# EAGLE design pet_cpu816-v1.2b (EAGLE 4.15)
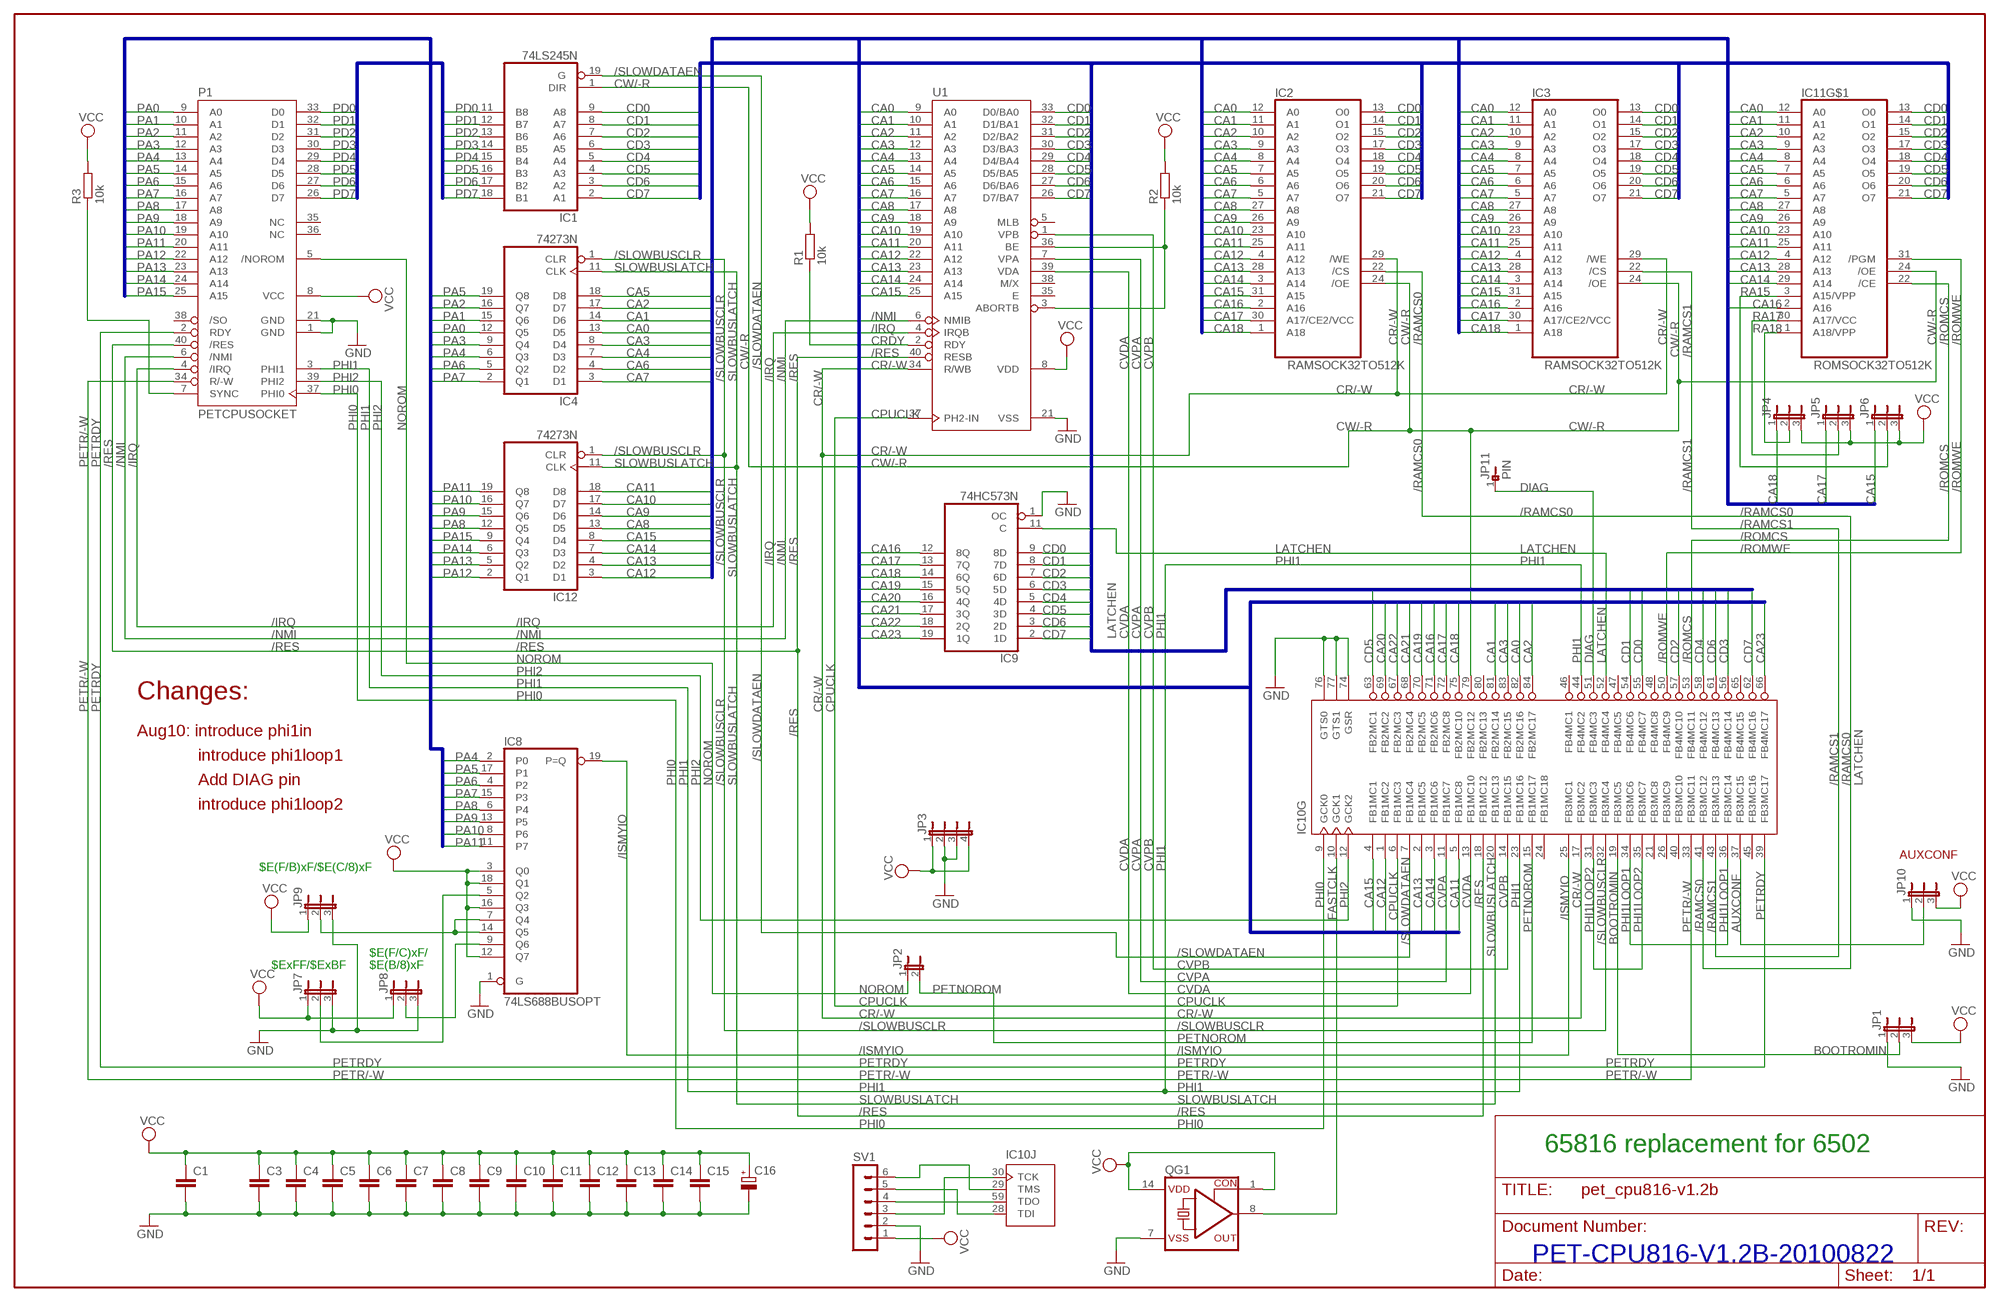
[diagram p0: schematic, sheet 1]

## Parts
C1  C-EU050-025X075  [C050-025X075]
C3  C-EU050-025X075  [C050-025X075]
C4  C-EU050-025X075  [C050-025X075]
C5  C-EU050-025X075  [C050-025X075]
C6  C-EU050-025X075  [C050-025X075]
C7  C-EU050-025X075  [C050-025X075]
C8  C-EU050-025X075  [C050-025X075]
C9  C-EU050-025X075  [C050-025X075]
C10  C-EU050-025X075  [C050-025X075]
C11  C-EU050-025X075  [C050-025X075]
C12  C-EU050-025X075  [C050-025X075]
C13  C-EU050-025X075  [C050-025X075]
C14  C-EU050-025X075  [C050-025X075]
C15  C-EU050-025X075  [C050-025X075]
C16  CPOL-EUE2.5-7  [E2,5-7]
IC1  74LS245N  [DIL20]
IC2  RAMSOCK32TO512K  [DIL32OPT28]
IC3  RAMSOCK32TO512K  [DIL32OPT28]
IC4  74273N  [DIL20]
IC8  74LS688BUSOPT  [DIL20]
IC9  74HC573N  [DIL20]
IC10  XC9572PC84  [PLCC-S84]
IC11  ROMSOCK32TO512K  [DIL32OPT28]
IC12  74273N  [DIL20]
JP1  JP2E  [JP2]
JP2  JP1E  [JP1]
JP3  JP4E  [JP4]
JP4  JP2E  [JP2]
JP5  JP2E  [JP2]
JP6  JP2E  [JP2]
JP7  JP2E  [JP2]
JP8  JP2E  [JP2]
JP9  JP2E  [JP2]
JP10  JP2E  [JP2]
JP11  PIN  [PIN]
P1  PETCPUSOCKET  [DIL40]
QG1  CRYSTAL_RES-SG51  [SG51]
R1  10k  R-EU_0204/7  [0204/7]
R2  10k  R-EU_0204/7  [0204/7]
R3  10k  R-EU_0204/7  [0204/7]
SV1  MA06-1  [MA06-1]
U1  W65C816SP  [DIP-40]

## Nets
/IRQ: P1.4(/IRQ) U1.4(IRQB)
/ISMYIO: IC8.19(P=Q) IC10.25(G:FB3MC1)
/NMI: P1.6(/NMI) U1.6(NMIB)
/RAMCS0: IC2.22(/CS) IC10.41(G:FB3MC12)
/RAMCS1: IC3.22(/CS) IC10.43(G:FB3MC13)
/RES: IC10.18(G:FB1MC12) P1.40(/RES) U1.40(RESB)
/ROMCS: IC10.53(G:FB4MC11) IC11.22(/CE)
/ROMWE: IC10.50(G:FB4MC9) IC11.31(/PGM)
/SLOWBUSCLR: IC4.1(CLR) IC10.32(G:FB3MC4) IC12.1(CLR)
/SLOWDATAEN: IC1.19(G) IC10.7(G:FB1MC4)
AUXCONF: IC10.37(G:FB3MC15) JP10.2
BOOTROMIN: IC10.19(G:FB3MC5) JP1.2
CA0: IC2.12(A0) IC3.12(A0) IC4.13(D5) IC10.82(G:FB2MC16) IC11.12(A0) U1.9(A0)
CA1: IC2.11(A1) IC3.11(A1) IC4.14(D6) IC10.81(G:FB2MC14) IC11.11(A1) U1.10(A1)
CA2: IC2.10(A2) IC3.10(A2) IC4.17(D7) IC10.84(G:FB2MC17) IC11.10(A2) U1.11(A2)
CA3: IC2.9(A3) IC3.9(A3) IC4.8(D4) IC10.83(G:FB2MC15) IC11.9(A3) U1.12(A3)
CA4: IC2.8(A4) IC3.8(A4) IC4.7(D3) IC11.8(A4) U1.13(A4)
CA5: IC2.7(A5) IC3.7(A5) IC4.18(D8) IC11.7(A5) U1.14(A5)
CA6: IC2.6(A6) IC3.6(A6) IC4.4(D2) IC11.6(A6) U1.15(A6)
CA7: IC2.5(A7) IC3.5(A7) IC4.3(D1) IC11.5(A7) U1.16(A7)
CA8: IC2.27(A8) IC3.27(A8) IC11.27(A8) IC12.13(D5) U1.17(A8)
CA9: IC2.26(A9) IC3.26(A9) IC11.26(A9) IC12.14(D6) U1.18(A9)
CA10: IC2.23(A10) IC3.23(A10) IC11.23(A10) IC12.17(D7) U1.19(A10)
CA11: IC2.25(A11) IC3.25(A11) IC10.5(G:FB1MC8) IC11.25(A11) IC12.18(D8) U1.20(A11)
CA12: IC2.4(A12) IC3.4(A12) IC10.1(G:FB1MC2) IC11.4(A12) IC12.3(D1) U1.22(A12)
CA13: IC2.28(A13) IC3.28(A13) IC10.2(G:FB1MC5) IC11.28(A13) IC12.4(D2) U1.23(A13)
CA14: IC2.3(A14) IC3.3(A14) IC10.3(G:FB1MC6) IC11.29(A14) IC12.7(D3) U1.24(A14)
CA15: IC2.31(A15) IC3.31(A15) IC10.4(G:FB1MC1) IC12.8(D4) JP6.1 U1.25(A15)
CA16: IC2.2(A16) IC3.2(A16) IC9.12(8Q) IC10.71(G:FB2MC6) IC11.2(A16)
CA17: IC2.30(A17/CE2/VCC) IC3.30(A17/CE2/VCC) IC9.13(7Q) IC10.72(G:FB2MC8) JP5.1
CA18: IC2.1(A18) IC3.1(A18) IC9.14(6Q) IC10.75(G:FB2MC10) JP4.1
CA19: IC9.15(5Q) IC10.70(G:FB2MC5)
CA20: IC9.16(4Q) IC10.69(G:FB2MC2)
CA21: IC9.17(3Q) IC10.68(G:FB2MC4)
CA22: IC9.18(2Q) IC10.67(G:FB2MC3)
CA23: IC9.19(1Q) IC10.66(G:FB4MC17)
CD0: IC1.9(A8) IC2.13(O0) IC3.13(O0) IC9.9(8D) IC10.55(G:FB4MC7) IC11.13(O0) U1.33(D0/BA0)
CD1: IC1.8(A7) IC2.14(O1) IC3.14(O1) IC9.8(7D) IC10.54(G:FB4MC6) IC11.14(O1) U1.32(D1/BA1)
CD2: IC1.7(A6) IC2.15(O2) IC3.15(O2) IC9.7(6D) IC10.57(G:FB4MC10) IC11.15(O2) U1.31(D2/BA2)
CD3: IC1.6(A5) IC2.17(O3) IC3.17(O3) IC9.6(5D) IC10.56(G:FB4MC14) IC11.17(O3) U1.30(D3/BA3)
CD4: IC1.5(A4) IC2.18(O4) IC3.18(O4) IC9.5(4D) IC10.58(G:FB4MC12) IC11.18(O4) U1.29(D4/BA4)
CD5: IC1.4(A3) IC2.19(O5) IC3.19(O5) IC9.4(3D) IC10.63(G:FB2MC1) IC11.19(O5) U1.28(D5/BA5)
CD6: IC1.3(A2) IC2.20(O6) IC3.20(O6) IC9.3(2D) IC10.61(G:FB4MC13) IC11.20(O6) U1.27(D6/BA6)
CD7: IC1.2(A1) IC2.21(O7) IC3.21(O7) IC9.2(1D) IC10.62(G:FB4MC16) IC11.21(O7) U1.26(D7/BA7)
CPUCLK: IC10.6(G:FB1MC3) U1.37(PH2-IN)
CR/-W: IC2.29(/WE) IC3.29(/WE) IC10.17(G:FB3MC2) U1.34(R/WB)
CRDY: R1.1 U1.2(RDY)
CVDA: IC10.13(G:FB1MC10) U1.39(VDA)
CVPA: IC10.11(G:FB1MC7) U1.7(VPA)
CVPB: IC10.14(G:FB1MC15) U1.1(VPB)
CW/-R: IC1.1(DIR) IC2.24(/OE) IC3.24(/OE) IC10.79(G:FB2MC12) IC11.24(/OE)
DIAG: IC10.51(G:FB4MC3) JP11.1
FASTCLK: IC10.10(G:GCK1) QG1.8(OUT)
GND: C1.2 C3.2 C4.2 C5.2 C6.2 C7.2 C8.2 C9.2 C10.2 C11.2 C12.2 C13.2 C14.2 C15.2 C16.- IC8.1(G) IC9.1(OC) IC10.74(G:GSR) IC10.76(G:GTS0) IC10.77(G:GTS1) JP1.1 JP3.2 JP3.3 JP7.3 JP8.3 JP9.3 JP10.1 P1.1(GND) P1.21(GND) QG1.7(VSS) SV1.2 U1.21(VSS)
LATCHEN: IC9.11(C) IC10.52(G:FB4MC4)
N$1: IC10.30(J:TCK) SV1.3
N$2: IC10.59(J:TDO) SV1.4
N$3: IC10.28(J:TDI) SV1.5
N$4: IC10.29(J:TMS) SV1.6
N$5: IC8.9(Q6) JP8.2
N$6: IC8.5(Q2) JP7.2
N$7: IC8.7(Q4) IC8.14(Q5) JP9.2
N$24: R2.1 U1.3(ABORTB) U1.36(BE)
NOROM: JP2.1 P1.5(/NOROM)
PA0: IC4.12(Q5) P1.9(A0)
PA1: IC4.15(Q6) P1.10(A1)
PA2: IC4.16(Q7) P1.11(A2)
PA3: IC4.9(Q4) P1.12(A3)
PA4: IC4.6(Q3) IC8.2(P0) P1.13(A4)
PA5: IC4.19(Q8) IC8.17(P1) P1.14(A5)
PA6: IC4.5(Q2) IC8.4(P2) P1.15(A6)
PA7: IC4.2(Q1) IC8.15(P3) P1.16(A7)
PA8: IC8.6(P4) IC12.12(Q5) P1.17(A8)
PA9: IC8.13(P5) IC12.15(Q6) P1.18(A9)
PA10: IC8.8(P6) IC12.16(Q7) P1.19(A10)
PA11: IC8.11(P7) IC12.19(Q8) P1.20(A11)
PA12: IC12.2(Q1) P1.22(A12)
PA13: IC12.5(Q2) P1.23(A13)
PA14: IC12.6(Q3) P1.24(A14)
PA15: IC12.9(Q4) P1.25(A15)
PD0: IC1.11(B8) P1.33(D0)
PD1: IC1.12(B7) P1.32(D1)
PD2: IC1.13(B6) P1.31(D2)
PD3: IC1.14(B5) P1.30(D3)
PD4: IC1.15(B4) P1.29(D4)
PD5: IC1.16(B3) P1.28(D5)
PD6: IC1.17(B2) P1.27(D6)
PD7: IC1.18(B1) P1.26(D7)
PETNOROM: IC10.15(G:FB1MC17) JP2.2
PETR/-W: IC10.33(G:FB3MC11) P1.34(R/-W)
PETRDY: IC10.39(G:FB3MC17) P1.2(RDY)
PETSYNC: P1.7(SYNC) R3.1
PHI0: IC10.9(G:GCK0) P1.37(PHI0)
PHI1: IC10.23(G:FB1MC16) IC10.44(G:FB4MC2) P1.3(PHI1)
PHI1LOOP1: IC10.34(G:FB3MC6) IC10.36(G:FB3MC14)
PHI1LOOP2: IC10.31(G:FB3MC3) IC10.35(G:FB3MC7)
PHI2: IC10.12(G:GCK2) P1.39(PHI2)
RA15: IC11.3(A15/VPP) JP6.2
RA17: IC11.30(A17/VCC) JP5.2
RA18: IC11.1(A18/VPP) JP4.2
SLOWBUSLATCH: IC4.11(CLK) IC10.20(G:FB1MC13) IC12.11(CLK)
VCC: C1.1 C3.1 C4.1 C5.1 C6.1 C7.1 C8.1 C9.1 C10.1 C11.1 C12.1 C13.1 C14.1 C15.1 C16.+ IC8.3(Q0) IC8.12(Q7) IC8.16(Q3) IC8.18(Q1) JP1.3 JP3.1 JP3.4 JP4.3 JP5.3 JP6.3 JP7.1 JP8.1 JP9.1 JP10.3 P1.8(VCC) QG1.1(CON) QG1.14(VDD) R1.2 R2.2 R3.2 SV1.1 U1.8(VDD)
Unconnected: IC10.21(G:FB3MC8) IC10.24(G:FB1MC18) IC10.26(G:FB3MC9) IC10.40(G:FB3MC10) IC10.45(G:FB3MC16) IC10.46(G:FB4MC1) IC10.47(G:FB4MC5) IC10.48(G:FB4MC8) IC10.65(G:FB4MC15) IC10.80(G:FB2MC13) P1.35(NC) P1.36(NC) P1.38(/SO) U1.5(MLB) U1.35(E) U1.38(M/X)

## Buses
CD[0..7]
PD[0..7]
CA[0..23]
PA[0..15]

## Notes on the sheet
- Changes:
- Aug10: introduce phi1in
- introduce phi1loop1
- Add DIAG pin
- introduce phi1loop2
- AUXCONF
- $E(F/B)xF/$E(C/8)xF
- $E(F/C)xF/
- $ExFF/$ExBF | $E(B/8)xF
- 65816 replacement for 6502
- PET-CPU816-V1.2B-20100822

## Power pins joined to a net without a drawn wire
GND: IC1.10(GND) IC2.16(GND) IC3.16(GND) IC4.10(GND) IC8.10(GND) IC9.10(GND) IC10.8(P:GND) IC10.16(P:GND) IC10.27(P:GND) IC10.42(P:GND) IC10.49(P:GND) IC10.60(P:GND) IC11.16(GND) IC12.10(GND)
VCC: IC1.20(VCC) IC2.32(VCC) IC3.32(VCC) IC4.20(VCC) IC8.20(VCC) IC9.20(VCC) IC10.22(P:VCC) IC10.38(P:VCC) IC10.64(P:VCC) IC10.73(P:VCC) IC10.78(P:VCC) IC11.32(VCC) IC12.20(VCC)

## Library data of the parts
C1 C3-C15 = rcl:C-EU: CAPACITOR, European symbol
C16 = rcl:CPOL-EU: POLARIZED CAPACITOR, European symbol
IC1 = 74xx-us:74*245: Octal BUS TRANSCEIVER, 3-state
IC2 IC3 = csa:RAMSOCK32TO512K
IC4 IC12 = 74xx-us:74*273: Octal D type FLIP FLOP, clear
IC8 = csa:74LS688BUSOPT
IC9 = 74xx-us:74*573: 8-bit D latch BUS DRIVER
IC10 = XILINX:XC9572PC84
IC11 = csa:ROMSOCK32TO512K
JP1 JP4-JP10 = jumper:JP2E: JUMPER
JP2 = jumper:JP1E: JUMPER
JP3 = jumper:JP4E: JUMPER
JP11 = csa:PIN
P1 = csa:PETCPUSOCKET
QG1 = crystal:CRYSTAL_RES-: CRYSTAL RESONATOR
R1-R3 = rcl:R-EU_: RESISTOR, European symbol
SV1 = con-lstb:MA06-1: PIN HEADER
U1 = 65xxx:W65C816SP: Wetern Digital Version

## Board
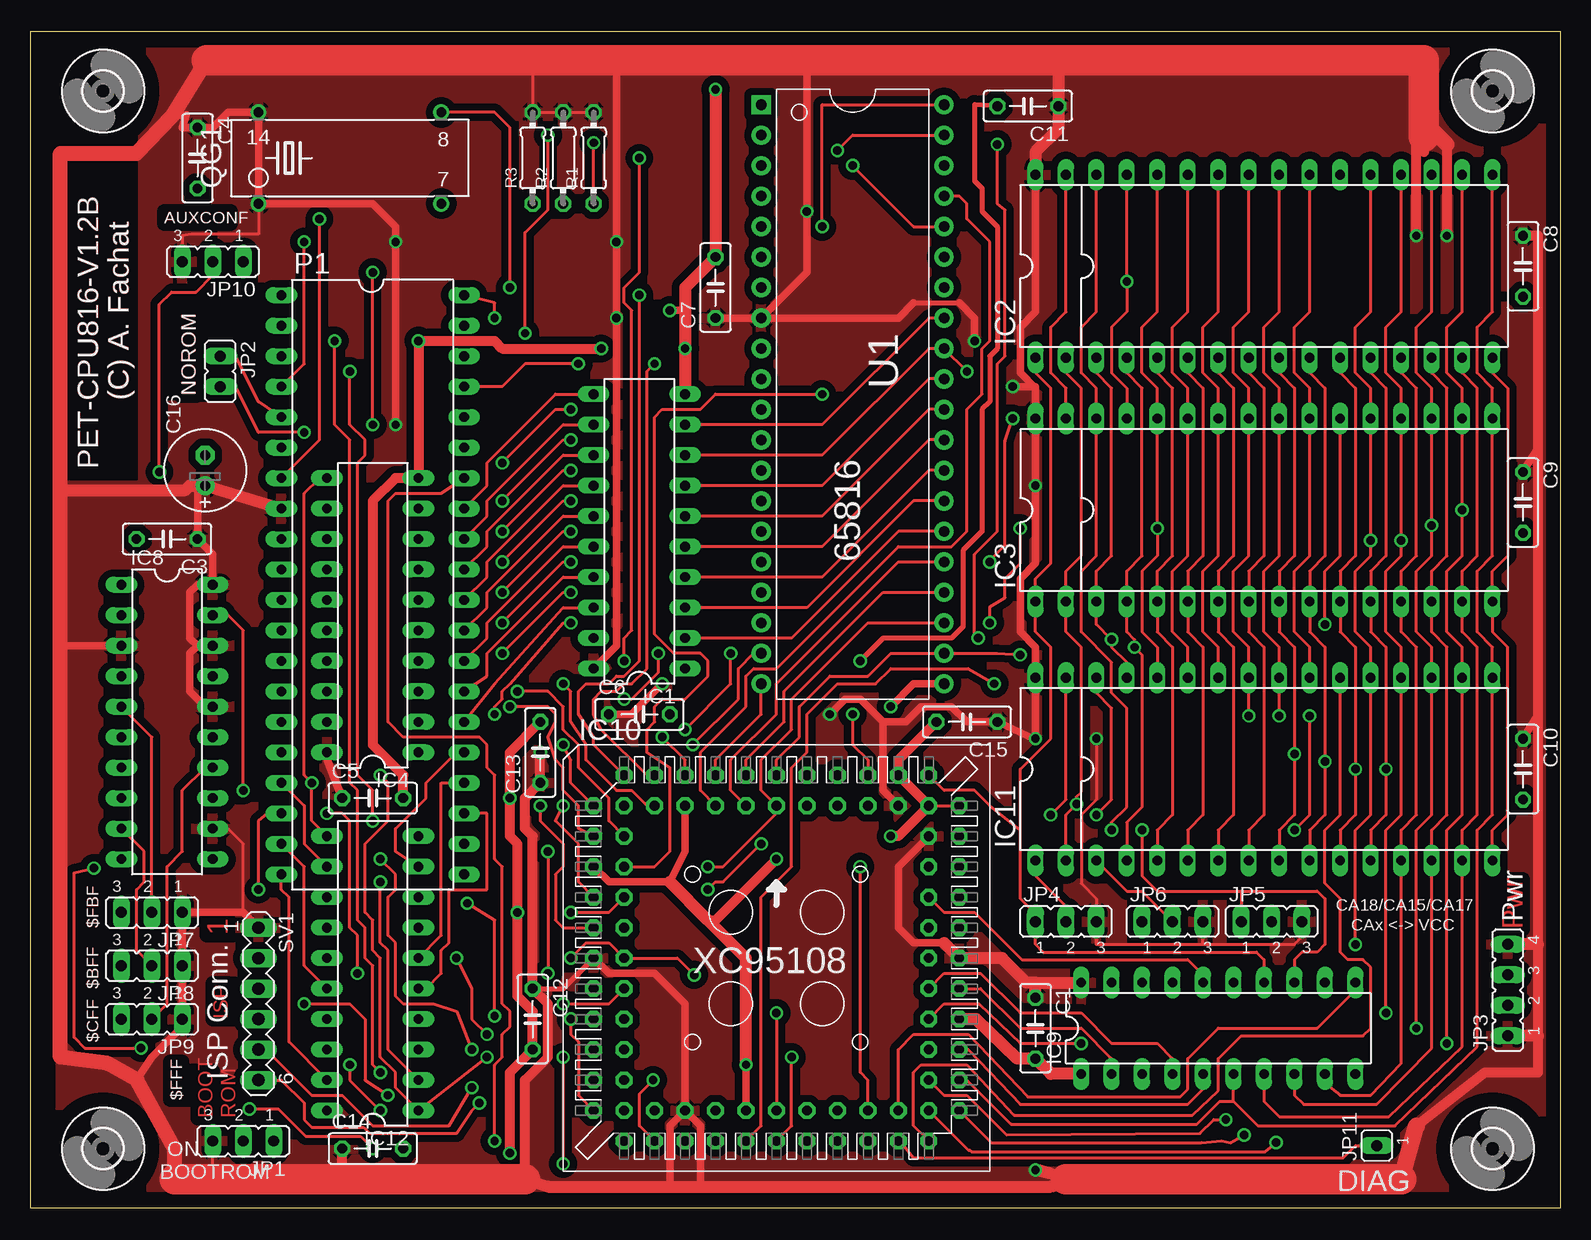
[diagram p1: board, top side]
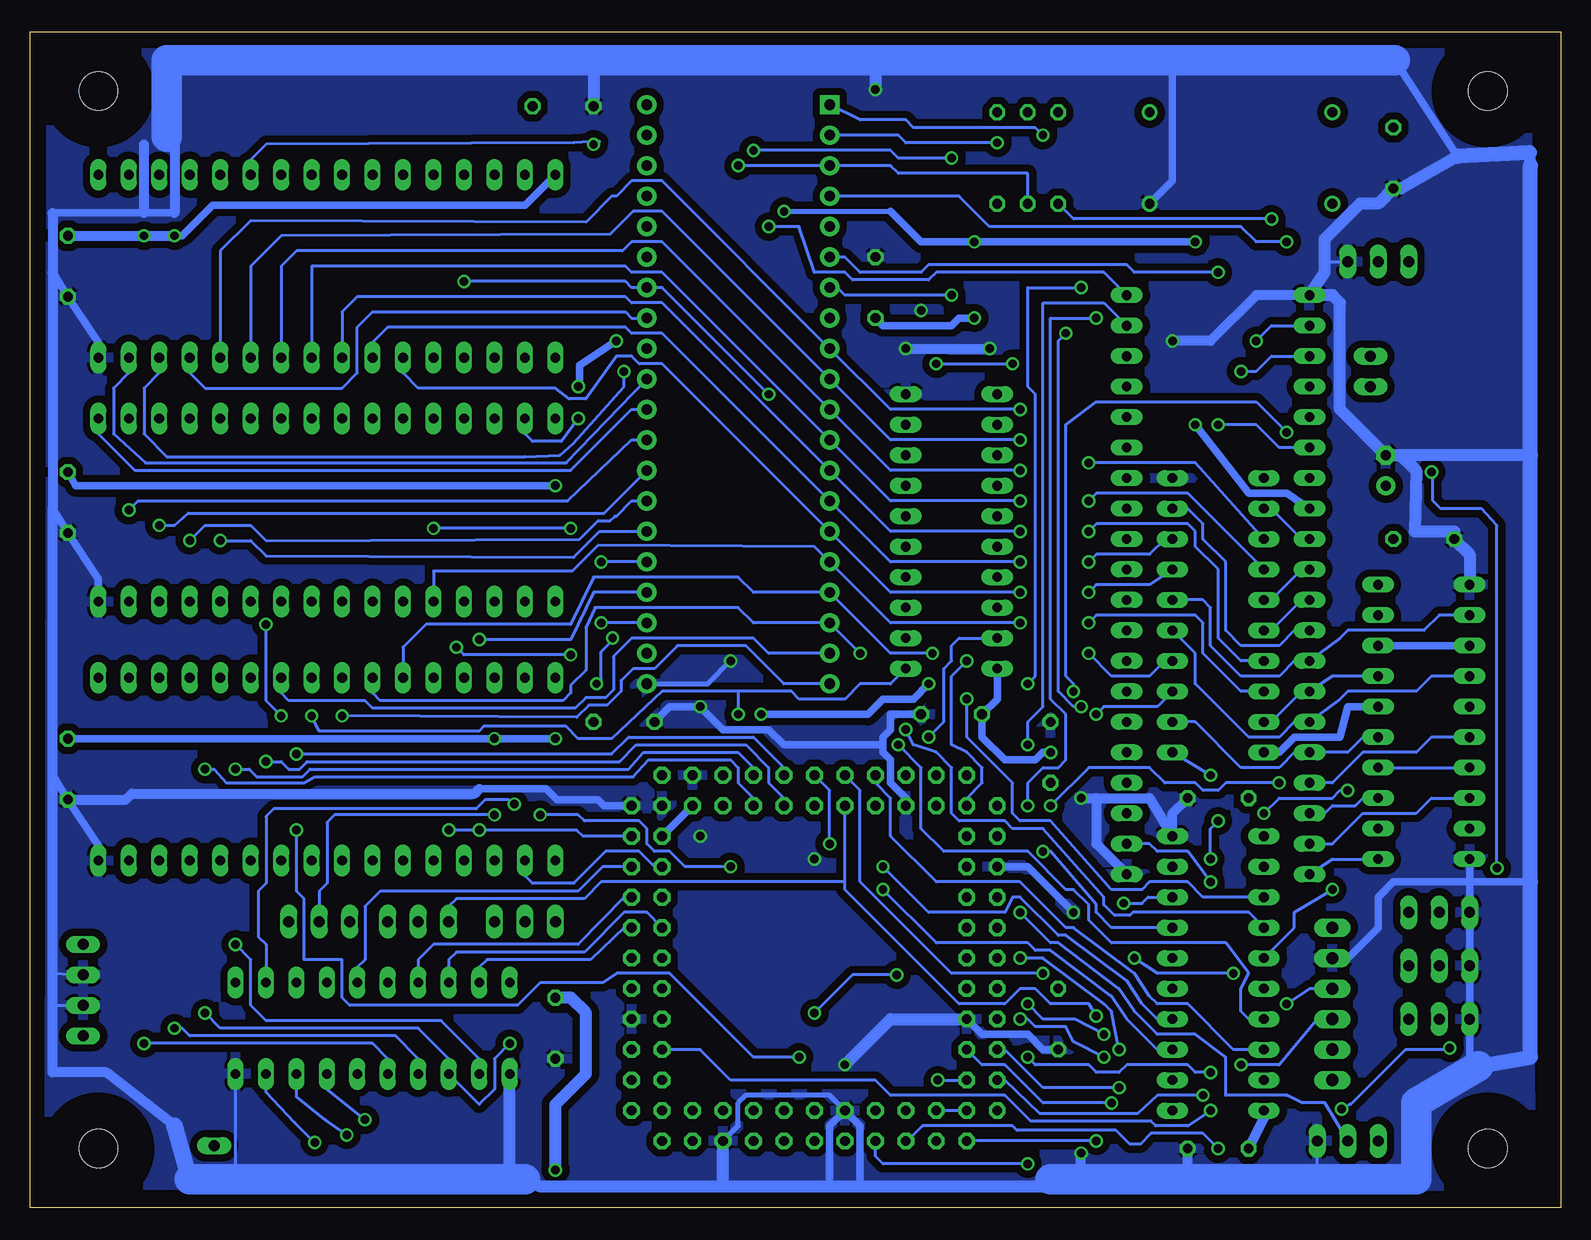
[diagram p2: board, bottom side, seen from below]

Size 127.62 x 97.97 mm. Coordinates in mm from the lower left corner, seen from the top.
Outline: 0,0 127.62,0 127.62,97.97 0,97.97 0,0
Copper layers (1*16): Top 0.035mm / dielectric 1.5mm / Bottom 0.035mm
Design rules "default": minimum track width 10mil, minimum drill 24mil, track to track 8mil, track to pad 8mil, pad to pad 8mil, via to via 8mil, smd to smd 8mil, copper to edge 40mil, drill to drill 8mil, minimum pad ring 10mil, minimum via ring 8mil, stop-mask expansion 4mil, vias tented up to drill 0mil, thermal gap 10mil

### Footprints (pad centres in the part's own frame; a part is rotated, then mirrored left to right if it is on the bottom)
C050-025X075 = drill 0.813 octagon: 1 -2.54,0; 2 2.54,0
E2,5-7 = drill 0.813 pad 1.6 round: + -1.27,0 | drill 0.813 pad 1.6 octagon: - 1.27,0
DIL20 = drill 0.813 long: 1 -11.43,-3.81; 2 -8.89,-3.81; 3 -6.35,-3.81; 4 -3.81,-3.81; 5 -1.27,-3.81; 6 1.27,-3.81; 7 3.81,-3.81; 8 6.35,-3.81; 9 8.89,-3.81; 10 11.43,-3.81; 11 11.43,3.81; 12 8.89,3.81; 13 6.35,3.81; 14 3.81,3.81; 15 1.27,3.81; 16 -1.27,3.81; 17 -3.81,3.81; 18 -6.35,3.81; 19 -8.89,3.81; 20 -11.43,3.81
DIL32OPT28 = drill 0.813 long: 1 -19.05,-7.62; 2 -16.51,-7.62; 3 -13.97,-7.62; 4 -11.43,-7.62; 5 -8.89,-7.62; 6 -6.35,-7.62; 7 -3.81,-7.62; 8 -1.27,-7.62; 9 1.27,-7.62; 10 3.81,-7.62; 11 6.35,-7.62; 12 8.89,-7.62; 13 11.43,-7.62; 14 13.97,-7.62; 15 16.51,-7.62; 16 19.05,-7.62; 17 19.05,7.62; 18 16.51,7.62; 19 13.97,7.62; 20 11.43,7.62; 21 8.89,7.62; 22 6.35,7.62; 23 3.81,7.62; 24 1.27,7.62; 25 -1.27,7.62; 26 -3.81,7.62; 27 -6.35,7.62; 28 -8.89,7.62; 29 -11.43,7.62; 30 -13.97,7.62; 31 -16.51,7.62; 32 -19.05,7.62
DIL20' = drill 0.813 long: 1 -10.16,-3.81; 2 -7.62,-3.81; 3 -5.08,-3.81; 4 -2.54,-3.81; 5 0,-3.81; 6 2.54,-3.81; 7 5.08,-3.81; 8 7.62,-3.81; 9 10.16,-3.81; 10 12.7,-3.81; 11 12.7,3.81; 12 10.16,3.81; 13 7.62,3.81; 14 5.08,3.81; 15 2.54,3.81; 16 0,3.81; 17 -2.54,3.81; 18 -5.08,3.81; 19 -7.62,3.81; 20 -10.16,3.81
PLCC-S84 = drill 0.813 pad 1.397 octagon: 1 0,15.24; 2 0,12.7; 3 -2.54,15.24; 4 -2.54,12.7; 5 -5.08,15.24; 6 -5.08,12.7; 7 -7.62,15.24; 8 -7.62,12.7; 9 -10.16,15.24; 10 -10.16,12.7; 11 -12.7,15.24; 12 -15.24,12.7; 13 -12.7,12.7; 14 -15.24,10.16; 15 -12.7,10.16; 16 -15.24,7.62; 17 -12.7,7.62; 18 -15.24,5.08; 19 -12.7,5.08; 20 -15.24,2.54; 21 -12.7,2.54; 22 -15.24,0; 23 -12.7,0; 24 -15.24,-2.54; 25 -12.7,-2.54; 26 -15.24,-5.08; 27 -12.7,-5.08; 28 -15.24,-7.62; 29 -12.7,-7.62; 30 -15.24,-10.16; 31 -12.7,-10.16; 32 -15.24,-12.7; 33 -12.7,-15.24; 34 -12.7,-12.7; 35 -10.16,-15.24; 36 -10.16,-12.7; 37 -7.62,-15.24; 38 -7.62,-12.7; 39 -5.08,-15.24; 40 -5.08,-12.7; 41 -2.54,-15.24; 42 -2.54,-12.7; 43 0,-15.24; 44 0,-12.7; 45 2.54,-15.24; 46 2.54,-12.7; 47 5.08,-15.24; 48 5.08,-12.7; 49 7.62,-15.24; 50 7.62,-12.7; 51 10.16,-15.24; 52 10.16,-12.7; 53 12.7,-15.24; 54 15.24,-12.7; 55 12.7,-12.7; 56 15.24,-10.16; 57 12.7,-10.16; 58 15.24,-7.62; 59 12.7,-7.62; 60 15.24,-5.08; 61 12.7,-5.08; 62 15.24,-2.54; 63 12.7,-2.54; 64 15.24,0; 65 12.7,0; 66 15.24,2.54; 67 12.7,2.54; 68 15.24,5.08; 69 12.7,5.08; 70 15.24,7.62; 71 12.7,7.62; 72 15.24,10.16; 73 12.7,10.16; 74 15.24,12.7; 75 12.7,15.24; 76 12.7,12.7; 77 10.16,15.24; 78 10.16,12.7; 79 7.62,15.24; 80 7.62,12.7; 81 5.08,15.24; 82 5.08,12.7; 83 2.54,15.24; 84 2.54,12.7
JP2 = drill 0.914 long: 1 -2.54,0; 2 0,0; 3 2.54,0
JP1 = drill 0.914 long: 1 0,-1.27; 2 0,1.27
JP4 = drill 0.914 long: 1 -3.81,0; 2 -1.27,0; 3 1.27,0; 4 3.81,0
PIN = drill 0.914 long: 1 0,0
DIL40 = drill 0.813 long: 1 -16.51,-7.62; 2 -13.97,-7.62; 3 -11.43,-7.62; 4 -8.89,-7.62; 5 -6.35,-7.62; 6 -3.81,-7.62; 7 -1.27,-7.62; 8 1.27,-7.62; 9 3.81,-7.62; 10 6.35,-7.62; 11 8.89,-7.62; 12 11.43,-7.62; 13 13.97,-7.62; 14 16.51,-7.62; 15 19.05,-7.62; 16 21.59,-7.62; 17 24.13,-7.62; 18 26.67,-7.62; 19 29.21,-7.62; 20 31.75,-7.62; 21 31.75,7.62; 22 29.21,7.62; 23 26.67,7.62; 24 24.13,7.62; 25 21.59,7.62; 26 19.05,7.62; 27 16.51,7.62; 28 13.97,7.62; 29 11.43,7.62; 30 8.89,7.62; 31 6.35,7.62; 32 3.81,7.62; 33 1.27,7.62; 34 -1.27,7.62; 35 -3.81,7.62; 36 -6.35,7.62; 37 -8.89,7.62; 38 -11.43,7.62; 39 -13.97,7.62; 40 -16.51,7.62
SG51 = drill 0.813 round: 1 -7.62,-3.81; 7 7.62,-3.81; 8 7.62,3.81; 14 -7.62,3.81
0204/7 = drill 0.813 octagon: 1 -3.81,0; 2 3.81,0
MA06-1 = drill 1.016 long: 1 -6.35,0; 2 -3.81,0; 3 -1.27,0; 4 1.27,0; 5 3.81,0; 6 6.35,0
DIP-40 = drill 0.889 pad 1.6 square: 1 -22.86,-7.62 | drill 0.889 pad 1.6 round: 2 -20.32,-7.62; 3 -17.78,-7.62; 4 -15.24,-7.62; 5 -12.7,-7.62; 6 -10.16,-7.62; 7 -7.62,-7.62; 8 -5.08,-7.62; 9 -2.54,-7.62; 10 0,-7.62; 11 2.54,-7.62; 12 5.08,-7.62; 13 7.62,-7.62; 14 10.16,-7.62; 15 12.7,-7.62; 16 15.24,-7.62; 17 17.78,-7.62; 18 20.32,-7.62; 19 22.86,-7.62; 20 25.4,-7.62; 21 25.4,7.62; 22 22.86,7.62; 23 20.32,7.62; 24 17.78,7.62; 25 15.24,7.62; 26 12.7,7.62; 27 10.16,7.62; 28 7.62,7.62; 29 5.08,7.62; 30 2.54,7.62; 31 0,7.62; 32 -2.54,7.62; 33 -5.08,7.62; 34 -7.62,7.62; 35 -10.16,7.62; 36 -12.7,7.62; 37 -15.24,7.62; 38 -17.78,7.62; 39 -20.32,7.62; 40 -22.86,7.62
3,2 = hole 3.2: 0,0

### Placement (x,y rotation side)
C1  83.81,14.95 270 top
C3  11.42,55.72 180 top
C4  13.96,87.46 270 top
C5  28.57,34.12 0 top
C6  50.79,41.11 0 top
C7  57.14,76.67 90 top
C8  124.45,78.45 270 top
C9  124.45,58.76 270 top
C10  124.45,36.54 270 top
C11  83.18,91.78 180 top
C12  41.9,15.71 270 top
C13  42.54,37.94 90 top
C14  28.57,4.92 0 top
C15  78.1,40.48 180 top
C16  14.6,61.43 90 top
IC1  50.79,56.35 90 top
IC2  102.87,78.45 0 top
IC3  102.87,58.13 0 top
IC4  28.57,49.37 90 top
IC8  74LS688BUSOPT  [DIL20']  11.42,41.74 270 top
IC9  99.06,14.95 0 top
IC10  62.22,20.79 0 top
IC11  102.87,36.54 0 top
IC12  28.57,19.52 90 top
JP1  17.78,5.55 180 top
JP2  15.87,69.68 180 top
JP3  123.19,18.12 90 top
JP4  86.36,23.84 0 top
JP5  103.5,23.84 0 top
JP6  95.25,23.84 0 top
JP7  10.15,24.6 180 top
JP8  10.15,20.16 180 top
JP9  10.15,15.71 180 top
JP10  15.23,78.83 180 top
JP11  112.26,5.17 90 top
P1  28.57,59.52 270 top
QG1  26.67,87.46 0 top
R1  46.98,87.46 90 top
R2  44.45,87.46 90 top
R3  41.9,87.46 90 top
SV1  19.05,16.98 270 top
U1  68.58,69.05 270 top
U$1  [3,2]  121.92,4.92 0 top
U$2  [3,2]  121.92,93.05 0 top
U$3  [3,2]  6.09,4.92 0 top
U$4  [3,2]  6.09,93.05 0 top

### Tracks (layer width: path | path; a pad name or v marks a point on that pad's centre or on a via)
/IRQ  (via drill 0.7)
  Top 0.254: v22.86,80.48 22.86,70.32 P1.4
  Bottom 0.254: U1.4 50.16,84.29 47.62,81.75 26.67,81.75 25.39,80.48 v22.86,80.48
/ISMYIO  (via drill 0.7)
  Top 0.254: IC8.19 16.51,49.37 17.78,48.09 v17.78,34.76 | v27.3,19.52 27.3,22.7 26.67,23.33 26.67,32.22 26.03,32.86 v24.76,32.86 | IC10.25 48.25,16.98 v44.45,16.98 | v35.55,20.79 36.82,18.25 36.82,15.71 v38.09,14.44
  Bottom 0.254: v17.78,34.76 18.41,34.76 19.05,34.12 23.49,34.12 v24.76,32.86 | v27.3,19.52 33.65,19.52 v35.55,20.79 | v38.09,14.44 40.51,15.71 43.17,15.71 v44.45,16.98
/NMI  (via drill 0.7)
  Top 0.254: v28.57,65.24 v28.57,77.94
  Bottom 0.254: U1.6 59.68,79.21 58.41,77.94 53.34,77.94 52.7,78.57 36.19,78.57 35.55,77.94 v28.57,77.94 | P1.6 23.49,63.34 25.39,65.24 v28.57,65.24
/RAMCS0  (via drill 0.7)
  Top 0.254: v80.64,88.61 80.64,83.65 81.28,83.15 81.28,70.95 80.64,70.32 80.64,56.35 78.73,54.45 78.73,47.78 v79.05,47.46 | v80.39,43.65 78.23,44.92 71.75,44.92 70.48,43.65 67.31,43.65 64.77,41.11 64.77,37.94 63.49,36.66 63.49,28.41 60.95,25.87 60.95,6.82 IC10.41
  Bottom 0.254: IC2.22 109.22,87.34 107.95,88.61 82.29,88.73 80.13,88.86 v80.64,88.61 | v80.39,43.65 80.01,44.03 80.01,46.32 79.05,47.27 v79.05,47.46
/RAMCS1  (via drill 0.7)
  Top 0.254: IC3.22 109.22,54.32 107.95,53.05 v107.95,48.6 | v105.41,31.46 106.68,32.73 v106.68,40.98 | v63.49,12.54 63.49,6.82 IC10.43
  Bottom 0.254: v105.41,31.46 105.41,26.38 104.77,25.74 104.77,20.66 101.59,20.66 101.59,17.49 100.96,16.85 86.99,16.85 85.09,18.76 79.88,18.76 78.73,19.52 74.29,19.52 67.31,12.54 v63.49,12.54 | v107.95,48.6 107.95,42.25 v106.68,40.98
/RES  (via drill 0.7)
  Top 0.254: U1.40 66.04,91.91 v66.04,81.75 | IC10.18 45.71,27.14 45.71,30.32 43.81,32.22 v44.45,33.49 | v38.73,74.13 38.73,75.4 P1.40
  Bottom 0.254: v66.04,81.75 63.49,81.75 62.22,77.94 59.68,77.94 59.05,77.3 52.7,77.3 52.06,77.94 38.09,77.94 P1.40 | v44.45,33.49 44.45,35.4 43.17,36.66 41.9,36.66 41.27,37.3 41.27,41.11 42.54,42.38 42.54,74.13 v38.73,74.13
/ROMCS
  Top 0.254: IC11.22 109.22,32.73 107.95,31.46 107.95,27.01 109.22,25.74 109.22,21.3 109.85,20.66 111.12,20.66 111.76,20.03 111.76,14.95 111.12,14.31 100.96,14.31 99.06,12.41 99.06,9.74 96.9,7.71 82.04,7.71 78.1,11.9 74.29,11.9 73.66,11.27 73.66,6.82 IC10.53
/ROMWE  (via drill 0.7)
  Top 0.254: v85.09,32.73 86.36,34 IC11.31 | v69.21,28.41 69.21,11.27 69.84,10.63 IC10.50
  Bottom 0.254: v85.09,32.73 81.91,32.73 81.4,32.22 76.83,32.22 76.2,31.59 76.2,30.32 75.56,29.68 74.29,29.68 73.02,28.41 v69.21,28.41
/SLOWBUSCLR  (via drill 0.7)
  Top 0.254: v45.08,15.71 45.08,14.44 45.71,13.81 45.71,9.36 IC10.32 | v38.09,12.54 IC12.1 30.48,10 30.48,11.27 29.21,12.54 29.21,20.79 28.57,21.43 28.57,23.96 27.94,24.6 27.94,30.32 29.84,32.22 29.84,35.4 v29.21,36.03
  Bottom 0.254: v45.08,15.71 44.45,15.71 43.81,15.08 41.27,15.08 40.63,13.81 v38.09,12.54 | v29.21,36.03 IC4.1
/SLOWDATAEN  (via drill 0.7)
  Top 0.254: v52.7,39.2 54.6,37.3 IC10.7
  Bottom 0.254: IC1.19 50.16,47.46 50.79,46.83 50.79,45.55 51.43,44.92 51.43,40.48 v52.7,39.2
AUXCONF  (via drill 0.7)
  Top 0.254: v28.57,4.92 27.55,5.93 22.98,5.93 20.7,8.22 v18.28,8.22 | v9.27,13.3 4.57,13.3 3.68,14.19 3.68,27.9 v5.33,28.28 | v10.79,61.3 10.79,75.27 11.81,76.29 13.84,76.29 15.23,77.69 JP10.2
  Bottom 0.254: IC10.37 54.48,5.55 53.21,6.82 45.71,6.82 45.33,6.44 37.08,6.44 35.94,5.3 35.05,5.3 34.16,6.18 29.84,6.18 v28.57,4.92 | v18.28,8.22 18.03,8.22 17.65,8.6 17.52,8.6 12.95,13.17 9.39,13.17 v9.27,13.3 | v5.33,28.28 5.33,56.86 6.6,58.26 10.03,58.26 10.66,58.89 10.66,61.18 v10.79,61.3
BOOTROMIN  (via drill 0.7)
  Top 0.254: IC10.19 48.25,24.6 v45.08,24.6
  Bottom 0.254: v45.08,24.6 42.54,22.06 41.9,22.06 36.82,18.25 35.55,16.35 33.65,14.44 30.48,14.44 27.94,12.54 27.94,9.36 22.86,9.36 21.59,8.73 19.68,8.73 JP1.2
CA0  (via drill 0.7)
  Top 0.254: IC2.12 111.76,69.56 113.03,68.29 113.03,54.32 111.76,53.05 IC3.12 111.76,47.97 113.03,46.7 v113.03,36.54 113.03,32.73 111.76,31.46 IC11.12 | v39.36,62.06 43.81,66.51 v45.08,66.51
  Bottom 0.254: IC2.12 111.76,79.72 109.22,82.26 81.28,82.13 79.12,84.29 78.73,84.29 77.47,85.56 74.93,85.56 U1.9 55.88,66.51 v45.08,66.51 | v113.03,36.54 112.26,36.54 111.25,35.4 104.77,35.4 103.88,35.9 77.34,35.9 76.07,37.3 69.21,37.3 68.58,36.66 68.58,35.4 67.31,34.12 IC10.82 | v39.36,62.06 30.48,62.06 IC4.13
CA1  (via drill 0.7)
  Top 0.254: IC2.11 109.22,69.56 110.48,68.29 110.48,54.32 109.22,53.05 IC3.11 109.22,47.97 110.48,46.7 v110.48,36.54 110.48,32.73 109.22,31.46 IC11.11 | v39.36,58.89 44.45,63.97 v45.08,63.97
  Bottom 0.254: IC2.11 109.22,78.45 106.68,80.99 79.24,81.11 77.34,83.02 74.93,83.02 U1.10 55.88,63.97 v45.08,63.97 | v110.48,36.54 109.34,36.54 108.71,35.9 104.9,35.9 104.26,36.54 77.72,36.54 76.45,37.94 68.58,37.94 67.31,36.66 IC10.81 | v39.36,58.89 38.73,59.52 31.11,59.52 IC4.14
CA2  (via drill 0.7)
  Top 0.254: IC11.10 106.68,31.46 107.95,32.73 v107.95,37.17 107.95,46.7 106.68,47.97 IC3.10 106.68,53.05 107.95,54.32 107.95,68.29 106.68,69.56 IC2.10 | v39.36,56.35 44.45,61.43 v45.08,61.43
  Bottom 0.254: IC2.10 106.68,78.45 105.41,79.72 78.23,79.72 77.47,80.48 74.93,80.48 U1.11 55.88,61.43 v45.08,61.43 | v107.95,37.17 106.68,37.17 106.04,36.54 105.15,36.54 104.52,37.17 78.48,37.17 77.08,38.57 67.94,38.57 66.04,36.66 66.04,35.4 64.77,34.12 IC10.84 | v39.36,56.35 38.73,56.98 31.11,56.98 30.48,56.35 30.48,55.08 28.57,53.18 28.57,47.46 26.67,45.55 IC4.17
CA3  (via drill 0.7)
  Top 0.254: IC11.9 104.14,31.46 105.41,32.73 v105.41,37.81 105.41,46.7 104.14,47.97 IC3.9 104.14,53.05 105.41,54.32 105.41,68.29 104.14,69.56 IC2.9 | v39.36,53.81 44.45,58.89 v45.08,58.89
  Bottom 0.254: IC2.9 104.14,78.45 77.97,78.45 77.47,77.94 74.93,77.94 U1.12 55.88,58.89 v45.08,58.89 | v105.41,37.81 79.12,37.81 77.72,39.2 67.31,39.2 64.77,36.66 IC10.83 | v39.36,53.81 38.73,54.45 34.28,54.45 33.02,55.72 IC4.8
CA4  (via drill 0.7)
  Top 0.254: IC11.8 101.59,31.46 102.87,32.73 102.87,46.7 101.59,47.97 IC3.8 101.59,53.05 102.87,54.32 102.87,68.29 101.59,69.56 IC2.8 | v39.36,51.27 44.45,56.35 v45.08,56.35
  Bottom 0.254: IC2.8 101.59,74.64 100.33,75.91 77.97,75.91 77.47,75.4 74.93,75.4 U1.13 55.88,56.35 v45.08,56.35 | v39.36,51.27 38.73,51.91 34.28,51.91 IC4.7
CA5  (via drill 0.7)
  Top 0.254: IC11.7 99.06,31.46 100.33,32.73 100.33,46.7 99.06,47.97 IC3.7 99.06,53.05 100.33,54.32 100.33,68.29 99.06,69.56 IC2.7 | v39.36,48.73 44.45,53.81 v45.08,53.81
  Bottom 0.254: IC2.7 99.06,72.1 97.79,73.37 77.97,73.37 77.47,72.86 74.93,72.86 U1.14 55.88,53.81 v45.08,53.81 | v39.36,48.73 38.73,49.37 30.48,49.37 29.84,48.73 29.84,46.19 26.67,43.02 IC4.18
CA6  (via drill 0.7)
  Top 0.254: IC11.6 96.52,31.46 97.79,32.73 97.79,46.7 96.52,47.97 IC3.6 96.52,53.05 97.79,54.32 97.79,68.29 96.52,69.56 IC2.6 | v39.36,46.19 44.45,51.27 v45.08,51.27
  Bottom 0.254: IC2.6 96.52,69.56 95.25,68.29 83.81,68.29 82.67,67.4 81.28,67.4 78.73,70.95 77.47,70.95 76.83,70.32 74.93,70.32 U1.15 55.88,51.27 v45.08,51.27 | v39.36,46.19 37.46,44.29 34.28,44.29 33.02,45.55 IC4.4
CA7  (via drill 0.7)
  Top 0.254: IC11.5 93.98,31.46 95.25,32.73 95.25,46.7 93.98,47.97 IC3.5 93.98,53.05 95.25,54.32 95.25,68.29 93.98,69.56 IC2.5 | v38.73,41.11 38.73,41.74 39.36,42.38 39.36,43.02 40,43.65 44.45,48.73 v45.08,48.73
  Bottom 0.254: IC3.5 93.98,53.05 82.42,53.05 80.26,55.21 62.22,55.08 U1.16 55.88,48.73 v45.08,48.73 | v38.73,41.11 38.09,41.74 33.65,41.74 IC4.3
CA8  (via drill 0.7)
  Top 0.254: IC2.27 96.52,74.64 95.25,73.37 95.25,69.56 96.52,68.29 IC3.27 96.52,54.32 95.25,53.05 95.25,47.97 96.52,46.7 IC11.27 | v49.52,42.38 50.16,42.38 52.38,44.6 v52.38,46.19
  Bottom 0.254: IC11.27 96.52,46.7 94.61,48.6 82.55,48.6 80.64,52.54 68.58,52.54 67.31,51.27 U1.17 55.88,46.19 v52.38,46.19 | v49.52,42.38 49.52,39.2 45.71,35.4 45.71,32.86 45.08,32.22 42.54,32.22 37.46,26.51 34.92,26.51 34.28,27.14 31.11,27.14 29.84,25.87 IC12.13
CA9  (via drill 0.7)
  Top 0.254: IC2.26 99.06,74.64 97.79,73.37 97.79,69.56 99.06,68.29 IC3.26 99.06,54.32 97.79,53.05 97.79,47.97 99.06,46.7 IC11.26 | v54.6,39.84 58.41,43.65 v58.41,46.19
  Bottom 0.254: IC11.26 99.06,42.89 98.42,42.25 83.18,42.25 82.55,42.89 82.55,43.52 81.28,44.79 81.28,48.35 80.51,50 68.58,50 67.31,48.73 U1.18 v58.41,46.19 | v54.6,39.84 53.97,38.57 52.06,37.94 50.79,36.66 50.79,32.86 50.16,32.22 46.35,32.22 45.71,31.59 43.17,31.59 38.09,25.87 38.09,25.23 37.21,24.35 35.94,24.35 35.68,24.6 26.03,24.6 IC12.14
CA10  (via drill 0.7)
  Top 0.254: IC2.23 106.68,74.64 105.41,73.37 105.41,69.56 106.68,68.29 IC3.23 106.68,54.32 105.41,53.05 105.41,47.97 106.68,46.7 IC11.23 | v55.24,38.57 59.05,42.38 59.05,44.92 60.32,46.19 U1.19
  Bottom 0.254: U1.19 66.04,46.19 67.31,47.46 77.47,47.46 78.99,45.94 78.99,43.14 79.62,42.51 81.28,42.51 82.16,41.62 99.06,41.62 99.69,42.25 106.04,42.25 106.68,42.89 IC11.23 | v55.24,38.57 53.34,36.66 53.34,31.59 51.43,29.68 44.45,29.68 41.27,26.51 40.63,26.51 39.36,25.23 39.36,23.96 37.46,22.06 27.94,22.06 26.03,19.52 26.67,18.25 26.67,16.35 26.03,15.71 IC12.17
CA11  (via drill 0.7)
  Top 0.254: IC2.25 101.59,74.64 100.33,73.37 100.33,69.56 101.59,68.29 IC3.25 101.59,54.32 100.33,53.05 100.33,47.97 101.59,46.7 IC11.25 v101.59,40.98 | U1.20 60.95,41.11 57.14,37.3 IC10.5
  Bottom 0.254: U1.20 64.77,43.65 67.94,46.83 73.66,46.83 75.56,44.92 77.34,44.92 78.35,43.9 78.35,43.02 79.5,41.87 81.02,41.87 82.04,40.86 v101.59,40.98 | IC10.5 57.14,35.4 55.88,34.12 55.88,30.95 52.06,27.14 45.08,27.14 41.27,23.33 40.63,23.33 35.55,19.52 34.28,17.62 33.65,16.98 31.11,16.98 27.3,13.17 IC12.18
CA12  (via drill 0.7)
  Top 0.254: IC2.4 91.44,69.56 92.7,68.29 92.7,54.32 91.44,53.05 IC3.4 91.44,47.97 92.07,47.33 v92.07,46.7 92.7,46.06 92.7,33.36 91.44,32.09 IC11.4 | v82.55,46.06 80.64,46.19 U1.22 71.75,46.19 69.84,44.29 66.67,44.29 64.13,41.74 64.13,39.2 62.22,37.3 IC10.1 | v56.51,26.51 57.14,27.14 57.78,27.14 v60.95,30.32
  Bottom 0.254: v82.55,46.06 91.44,46.06 v92.07,46.7 | v56.51,26.51 52.06,22.06 44.45,22.06 43.81,21.43 42.54,21.43 37.46,17.62 36.19,15.71 33.65,13.17 IC12.3 | v60.95,30.32 60.95,34.76 IC10.1
CA13  (via drill 0.7)
  Top 0.254: IC2.28 93.98,74.64 92.7,73.37 92.7,69.56 93.98,68.29 IC3.28 v93.98,56.6 93.98,54.32 92.7,53.05 92.7,47.97 93.98,46.7 IC11.28 | v80.01,48.73 80.01,50.06 81.28,50.83 81.28,52.41 82.55,53.68 v82.55,56.6 | U1.23 69.84,48.73 63.49,42.38 63.49,39.84 60.95,37.3 60.95,34.76 IC10.2 62.22,32.86 57.78,28.41 v56.51,28.41
  Bottom 0.254: v82.55,56.6 v93.98,56.6 | U1.23 v80.01,48.73 | v56.51,28.41 52.7,24.6 46.35,24.6 45.71,25.87 45.08,25.87 41.9,22.7 41.27,22.7 36.19,18.89 34.92,16.98 33.65,15.71 IC12.4
CA14  (via drill 0.7)
  Top 0.254: IC2.3 88.9,69.56 90.17,68.29 90.17,54.32 88.9,53.05 IC3.3 88.9,48.6 v90.17,47.33 90.17,46.7 91.44,45.43 IC11.29 | U1.24 71.12,51.27 62.86,43.02 62.86,40.48 59.68,37.3 IC10.3 | v43.17,29.68 v43.17,19.52
  Bottom 0.254: U1.24 80.64,51.27 82.55,47.33 v90.17,47.33 | IC10.3 58.41,34.76 58.41,27.14 50.79,19.52 v43.17,19.52 | v43.17,29.68 42.54,29.68 38.73,25.23 38.73,24.6 37.46,23.33 IC12.7
CA15  (via drill 0.7)
  Top 0.254: IC2.31 86.36,74.64 85.09,73.37 85.09,69.56 86.36,68.29 IC3.31 | v81.91,65.75 81.28,63.84 81.28,55.21 80.01,53.94 v80.01,53.81 | U1.25 72.39,53.81 62.22,43.65 62.22,41.11 58.41,37.3 58.41,34.76 IC10.4 | v38.73,15.96 38.73,23.96 v36.44,25.36
  Bottom 0.254: IC3.31 86.36,64.48 85.72,63.84 83.31,63.84 v81.91,65.75 | U1.25 v80.01,53.81 | 59.68,27.14 59.68,26.51 50.16,16.98 46.35,16.98 45.08,18.25 43.81,18.25 42.54,16.98 39.36,16.98 v38.73,15.96 | 59.68,27.14 IC10.4 | JP6.1 92.7,25.11 92.07,25.74 81.4,25.74 80.01,27.14 59.68,27.14 | v36.44,25.36 34.92,25.36 34.41,25.87 IC12.8
CA16  (via drill 0.7)
  Top 0.254: IC2.2 86.36,69.56 87.62,68.29 87.62,54.32 86.36,53.05 IC3.2 86.36,47.97 87.62,46.7 87.62,34.63 87.24,34.25 v87.24,33.62 86.36,32.73 IC11.2
  Bottom 0.254: IC10.71 75.56,28.41 76.83,29.68 79.62,29.68 82.29,27.01 85.72,27.01 86.36,27.65 IC11.2 | IC9.12 107.95,21.93 108.58,22.57 108.58,26.38 107.95,27.01 107.95,32.6 107.31,33.24 90.42,33.24 89.66,34 87.75,34 87.37,33.62 v87.24,33.62
CA17  (via drill 0.7)
  Top 0.254: IC2.30 88.9,74.64 87.62,73.37 87.62,69.56 88.9,68.29 IC3.30 88.9,54.32 87.62,53.05 87.62,47.97 90.17,45.43 90.17,42.89 91.44,41.62 91.44,33.36 90.17,32.09 v90.17,31.46 | IC9.13 105.41,20.66 106.04,21.3 107.31,21.3 107.95,21.93 107.95,25.74 107.31,26.38 100.96,26.38 | 100.96,26.38 93.98,26.38 92.7,27.65 v92.7,31.46 | 100.96,26.38 JP5.1
  Bottom 0.254: IC10.72 81.53,30.95 82.04,31.46 v90.17,31.46 v92.7,31.46
CA18
  Top 0.254: IC2.1 83.81,69.56 85.09,68.29 85.09,53.68 83.81,52.41 IC3.1 83.81,47.97 85.09,46.7 85.09,39.08 82.55,36.54 82.55,31.46 | IC10.75 76.2,34.76 78.73,34.76 80.01,33.49 82.55,31.46 | 82.55,31.46 82.55,25.74 83.81,24.47 JP4.1 83.81,21.93 84.45,21.3 102.23,21.3 102.87,20.66 IC9.14
CA19
  Bottom 0.254: IC10.70 79.88,28.41 81.91,26.38 98.42,26.38 99.69,25.11 99.69,20.66 100.33,20.03 IC9.15
CA20
  Top 0.254: IC9.16 97.79,19.39 96.52,20.66 82.67,20.66 78.73,24.6 76.2,24.6 IC10.69
CA21
  Bottom 0.254: IC10.68 78.1,25.87 81.91,21.93 93.98,21.93 95.25,20.66 IC9.17
CA22
  Bottom 0.254: IC10.67 76.2,24.6 78.1,24.6 81.4,21.3 92.07,21.3 92.7,20.66 IC9.18
CA23
  Bottom 0.254: IC10.66 78.1,23.33 80.89,20.66 89.53,20.66 90.17,20.03 IC9.19
CD0  (via drill 0.7)
  Top 0.254: IC2.13 114.3,69.56 115.56,68.29 115.56,54.32 114.3,53.05 IC3.13 114.3,47.97 115.56,46.7 115.56,32.73 114.3,31.46 IC11.13 114.3,12.03 111.76,9.36 109.22,9.36 107.95,10.38 IC9.9 | U1.33 74.93,74.13 66.04,65.24 IC1.9 | v103.88,5.42 102.99,4.66 78.48,4.66 78.35,4.79 78.23,4.79 IC10.55
  Bottom 0.254: U1.33 77.47,74.13 77.97,74.64 99.06,74.64 100.33,73.37 100.33,69.56 101.59,68.29 113.03,68.29 114.3,69.56 IC2.13 | v103.88,5.42 105.53,7.07 107.95,9.61 IC9.9
CD1  (via drill 0.7)
  Top 0.254: IC2.14 116.84,69.56 118.11,68.29 118.11,54.32 116.84,53.05 IC3.14 116.84,47.97 118.11,46.7 118.11,32.73 116.84,31.46 IC11.14 116.84,13.3 112.26,8.6 106.17,8.6 105.41,9.36 IC9.8 | v78.1,69.68 U1.32 74.93,71.59 66.04,62.7 IC1.8 | IC10.54 80.13,5.42 97.66,5.42 99.31,5.55 100.07,5.42 v101.21,6.06
  Bottom 0.254: v78.1,69.68 78.1,68.41 82.29,63.72 83.43,62.7 86.36,62.57 116.2,62.57 118.11,64.48 118.11,68.29 116.84,69.56 IC2.14 | v101.21,6.06 102.99,7.33 105.41,9.23 IC9.8
CD2  (via drill 0.7)
  Top 0.254: IC2.15 119.38,69.56 120.65,68.29 120.65,54.32 119.38,53.05 IC3.15 119.38,47.97 120.65,46.7 120.65,32.73 119.38,31.46 IC11.15 119.38,13.42 113.28,7.58 104.14,7.58 102.87,8.85 IC9.7 | U1.31 74.93,69.05 66.04,60.16 IC1.7 | v99.69,7.33 98.67,7.33 97.53,6.18 81.4,6.06 78.1,9.36 76.2,9.36 IC10.57
  Bottom 0.254: U1.31 82.93,62.06 117.98,62.06 120.65,64.48 120.65,68.29 119.38,69.56 IC2.15 | v99.69,7.33 102.87,9.87 IC9.7
CD3
  Top 0.254: IC2.17 121.92,74.64 120.65,73.37 120.65,69.56 121.92,68.29 IC3.17 121.92,54.32 120.65,53.05 120.65,47.97 121.92,46.7 IC11.17 121.92,32.73 120.65,31.46 120.65,13.42 113.79,6.82 102.36,6.82 100.33,8.85 | 100.33,8.85 IC9.6 | U1.30 74.93,66.51 66.04,57.62 IC1.6 | IC10.56 78.1,10.63 81.78,6.95 97.28,6.95 99.18,8.85 100.33,8.85
  Bottom 0.254: U1.30 77.47,66.51 82.55,61.43 118.87,61.43 121.92,64.48 IC3.17
CD4  (via drill 0.7)
  Top 0.254: IC2.18 119.38,74.64 118.11,73.37 118.11,69.56 119.38,68.29 IC3.18 v119.38,58.13 119.38,54.32 118.11,53.05 118.11,47.97 119.38,46.7 IC11.18 119.38,32.73 118.11,31.46 v118.11,13.68 | U1.29 74.93,63.97 66.04,55.08 IC1.5 | IC10.58 78.23,13.17 82.55,8.6 96.52,8.6 97.79,9.87 IC9.5
  Bottom 0.254: v118.11,13.68 99.06,13.68 97.79,12.41 IC9.5 | U1.29 77.47,63.97 82.8,58.89 118.61,58.89 v119.38,58.13
CD5  (via drill 0.7)
  Top 0.254: IC2.19 116.84,74.64 115.56,73.37 115.56,69.56 116.84,68.29 IC3.19 v116.84,56.86 116.84,54.32 115.56,53.05 115.56,47.97 116.84,46.7 IC11.19 116.84,32.73 115.56,31.46 v115.56,14.95 | U1.28 74.93,61.43 66.04,52.54 IC1.4 | IC10.63 76.2,19.52 79.24,19.52 82.55,16.22 87.62,16.22 90.17,13.68 93.98,13.68 95.25,12.41 IC9.4
  Bottom 0.254: v115.56,14.95 114.93,14.95 114.3,14.31 97.15,14.31 95.25,12.41 IC9.4 | U1.28 79.75,57.87 114.42,57.87 115.56,56.86 v116.84,56.86
CD6  (via drill 0.7)
  Top 0.254: IC2.20 114.3,74.64 113.03,73.37 113.03,69.56 114.3,68.29 IC3.20 v114.3,55.59 114.3,54.32 113.03,53.05 113.03,47.97 114.3,46.7 IC11.20 114.3,32.73 113.03,31.46 v113.03,16.22 | U1.27 73.66,58.89 64.77,50 IC1.3 | IC10.61 76.2,16.98 79.12,16.98 82.55,13.68 v87.62,13.68
  Bottom 0.254: v113.03,16.22 111.76,14.95 95.25,14.95 92.7,12.41 IC9.3 90.17,8.6 88.9,9.87 88.9,12.41 v87.62,13.68 | U1.27 77.47,58.89 78.73,57.62 78.86,57.62 79.24,57.24 80.26,57.24 81.78,55.72 107.95,55.59 109.22,56.86 113.03,56.86 v114.3,55.59
CD7  (via drill 0.7)
  Top 0.254: IC2.21 111.76,74.64 110.48,73.37 110.48,69.56 111.76,68.29 IC3.21 v111.76,55.59 111.76,54.32 110.48,53.05 110.48,47.97 111.76,46.7 IC11.21 111.76,32.73 110.48,31.46 v110.48,21.93 | IC9.2 90.17,12.41 87.62,14.95 82.55,14.95 79.24,18.25 IC10.62 | U1.26 72.39,56.35 63.49,47.46 IC1.2
  Bottom 0.254: U1.26 80.13,56.35 82.29,54.19 107.95,54.32 109.22,55.59 v111.76,55.59 | v110.48,21.93 109.22,20.66 109.22,16.85 107.95,15.58 93.34,15.58 90.17,12.41 IC9.2
CPUCLK
  Top 0.254: IC10.6 55.88,34.76 55.88,37.94 59.68,41.74 59.68,44.29 60.32,44.92 62.22,44.92 72.39,55.08 76.83,55.08 78.1,56.35 78.1,66.51 79.37,67.78 79.37,71.59 80.01,72.22 80.01,80.48 78.1,82.38 78.1,83.65 77.47,84.29 U1.37
CR/-W  (via drill 0.7)
  Top 0.254: IC2.29 v91.44,77.18 91.44,74.64 90.17,73.37 90.17,69.56 91.44,68.29 IC3.29 | IC10.17 52.06,28.41 53.34,29.68 53.34,36.66 51.43,37.94 51.43,39.84 52.06,40.48 52.06,41.74 52.7,42.38 54.6,42.38 56.51,44.29 56.51,45.55 55.88,46.19 53.65,46.19 52.06,47.78 52.06,65.88 52.7,66.51 55.88,66.51 57.14,67.78 v66.04,67.78
  Bottom 0.254: v91.44,77.18 77.97,77.18 77.47,76.67 U1.34 74.93,76.67 v66.04,67.78
CRDY  (via drill 0.7)
  Top 0.254: R1.1 v46.98,88.73
  Bottom 0.254: v46.98,88.73 54.6,88.73 55.24,89.37 U1.2
CVDA  (via drill 0.7)
  Top 0.254: U1.39 68.58,89.37 v67.31,88.1 | v49.52,45.55 49.52,47.46 50.16,48.09 50.16,74.77 49.52,75.4 49.52,76.67 50.79,77.94 v50.79,87.46
  Bottom 0.254: IC10.13 49.52,34.12 48.25,35.4 48.25,36.66 49.52,37.94 50.79,38.57 50.79,44.29 v49.52,45.55 | v50.79,87.46 55.24,87.46 55.88,88.1 v67.31,88.1
CVPA  (via drill 0.7)
  Top 0.254: IC10.11 46.98,38.57 46.98,39.2 45.71,41.11 45.71,43.02 46.35,43.65 48.25,43.65 48.89,44.29 49.52,44.29 50.79,45.55 v50.79,76.03
  Bottom 0.254: U1.7 60.32,76.67 59.68,76.03 v50.79,76.03
CVPB  (via drill 0.7)
  Top 0.254: IC10.14 45.71,31.59 45.71,33.49 44.45,34.76 44.45,36.66 43.81,37.3 43.17,39.2 43.81,40.48 43.81,41.11 43.17,41.74 v40,41.74 | v41.27,72.86 41.27,81.24 43.17,83.15 v43.17,89.37
  Bottom 0.254: v40,41.74 40.63,41.74 41.9,43.02 41.9,72.22 v41.27,72.86 | v43.17,89.37 43.81,90 53.97,90 54.6,90.64 58.41,90.64 U1.1
CW/-R  (via drill 0.7)
  Top 0.254: IC2.24 104.14,74.64 102.87,73.37 102.87,69.56 104.14,68.29 IC3.24 104.14,54.32 102.87,53.05 102.87,47.97 104.14,46.7 IC11.24 v104.14,40.98 | v68.58,41.11 68.58,38.57 69.84,37.3 IC10.79
  Bottom 0.254: 68.58,43.02 64.13,43.02 63.49,42.38 59.68,42.38 58.41,43.65 55.88,43.65 IC1.1 | 68.58,43.02 74.93,43.02 79.12,39.08 81.91,39.08 82.93,40.09 89.78,40.09 90.17,39.71 103.5,39.71 v104.14,40.98 | 68.58,43.02 v68.58,41.11
DIAG
  Top 0.254: IC10.51 72.51,5.55 73.66,4.15 109.47,4.15 110.48,5.17 JP11.1
FASTCLK  (via drill 0.7)
  Top 0.254: IC10.10 51.43,33.49 50.16,34.76 48.89,34.76 46.35,37.3 46.35,38.57 45.08,40.48 45.08,43.02 v44.45,43.65 | QG1.8 38.73,91.27 40,90 v40,76.67
  Bottom 0.254: v40,76.67 44.45,76.67 44.45,68.41 43.81,67.78 43.81,44.29 v44.45,43.65
GND  (via drill 0.7)
  Top 0.254: IC2.16 121.92,69.56 123.19,68.29 123.19,54.32 121.92,53.05 IC3.16 121.92,47.97 123.19,46.7 123.19,32.73 121.92,31.46 IC11.16 | IC10.76 IC10.74
  Top 0.406: C11.2 78.73,91.91 78.73,85.56 79.37,84.92 79.37,83.02 80.64,81.75 80.64,71.59 80.01,70.95 80.01,67.14 79.37,66.51 79.37,56.35 77.78,54.76 77.78,48.41 76.83,47.46 71.12,47.46 v69.21,45.55
  Top 0.61: IC10.16 48.25,27.14 53.34,27.14 54.6,29.68 IC10.8 | IC10.42 v59.68,11.9 | 54.6,74.77 v53.34,74.77 | v71.75,41.74 73.66,43.65 U1.21
  Top 0.813: v40,4.53 40,11.27 C12.2 41.9,16.35 40.63,17.62 v40.63,24.6 40.63,30.32 40,30.95 v40,34.12 40,37.94 C13.2 | v71.75,30.95 72.39,30.95 IC10.76 IC10.77 72.39,37.3 C15.2 | 56.51,23.96 57.14,23.96 v62.22,29.05 | v47.62,71.59 39.36,71.59 38.73,72.22 v32.38,72.22 IC4.10 30.48,60.8 28.57,58.89 28.57,38.57 31.11,36.03 C5.2
  Top 1.016: IC10.60 78.86,15.71 82.29,12.41 C1.2 85.09,11.14 IC9.1 | v57.14,93.18 C7.2 54.6,76.67 54.6,74.77 v54.6,71.59 IC1.10 | 53.34,27.14 56.51,23.96 59.68,20.79 v59.68,11.9
  Bottom 0.254: 110.48,2.38 IC9.10 | 125.73,16.85 JP3.2 | 125.73,19.52 JP3.3 | 20.32,2.38 JP1.1 | 19.68,78.83 JP10.1
  Bottom 0.406: IC10.49 68.58,6.82 68.58,8.73 67.94,9.36 60.95,9.36 IC10.42 | IC10.8 54.6,34.12 | v69.21,45.55 71.12,43.65 U1.21
  Bottom 0.61: 8.63,87.59 13.84,95.59 | 116.2,89.24 115.56,88.61 | 115.56,82.89 118.11,82.89 125.73,82.89 | IC2.16 121.92,72.1 C8.2 125.73,77.94 | IC3.16 121.92,52.41 C9.2 125.73,58.26 | IC11.16 121.92,30.19 C10.2 125.73,36.03 | C12.2 43.17,13.17 44.45,14.44 48.25,14.44 IC10.27 | v40.63,24.6 44.45,28.41 IC10.16 | 56.51,38.57 56.51,37.94 55.88,37.3 55.88,35.4 54.6,34.12 | 56.51,38.57 56.51,39.2 55.88,39.84 55.88,41.11 C6.2 | C15.2 74.29,41.74 v71.75,41.74 69.84,39.84 66.04,39.84 64.77,38.57 56.51,38.57 | 7.62,27.14 JP7.3 JP8.3 | 7.62,27.14 IC8.10 | JP8.3 JP9.3 7.62,12.54 6.88,11.8 6.88,11.78 | JP8.3 7.62,21.43 | SV1.2 17.78,20.79 15.23,23.33 15.23,25.87 13.96,27.14 7.62,27.14 | QG1.7 32.38,85.56 32.38,95.59 | 58.41,1.74 58.41,6.82 IC10.42 60.95,6.82 60.95,1.74 | 2.54,27.14 7.62,27.14 | 90.17,34.89 84.58,34.89 83.69,34 80.26,34 79.75,33.49 IC10.74
  Bottom 0.813: 115.56,88.61 115.56,82.89 | 125.73,82.89 125.73,77.94 125.73,58.26 125.73,36.03 125.73,19.52 125.73,16.85 125.73,11.27 121.28,11.27 115.56,6.82 | 40,2.38 v40,4.53 | 118.11,82.89 118.11,88.61 | v54.6,71.59 v47.62,71.59 | 31.11,2.38 C14.2 | C5.2 32.38,32.86 IC12.10 34.28,34.12 38.73,34.12 | 38.73,34.12 38.73,30.32 P1.21 | v40,34.12 38.73,34.12 | P1.1 25.39,76.03 29.21,72.22 v32.38,72.22 | C10.2 119.63,34 119.12,34.51 90.55,34.51 90.17,34.89
  Bottom 1.016: 2.54,86.83 2.6,87.91 | 87.62,2.38 IC9.1 | 69.84,1.74 60.95,1.74 58.41,1.74 43.17,1.74 42.54,2.38 | 69.84,1.74 85.09,1.74 86.36,2.38 | 69.84,1.74 IC10.49 | 57.14,95.59 v57.14,93.18 | 80.64,95.59 C11.2 | IC10.27 55.88,15.71 v59.68,11.9 | IC8.1 7.62,54.45 C3.2 8.88,56.35 12.19,56.35 12.06,61.43 13.33,62.7 C16.- | C16.- 18.41,66.51 18.41,75.4 19.05,76.03 P1.1 19.68,77.94 19.68,78.83 19.68,80.73 16.76,83.65 15.23,83.65 C4.2 13.33,84.92 8.63,87.59 | 2.54,62.7 C16.-
  Bottom 1.27: 6.88,11.78 2.54,12.54 2.54,27.14 2.54,62.7 2.54,86.83 | 2.6,87.91 8.63,87.59
  Bottom 1.422: 114.3,2.38 115.56,6.82
  Bottom 2.54: 6.88,11.78 12.06,8.73 12.06,2.38 20.32,2.38 31.11,2.38 40,2.38 42.54,2.38 | 13.84,95.59 32.38,95.59 57.14,95.59 80.64,95.59 116.2,95.59 116.2,89.24 | 114.3,2.38 110.48,2.38 87.62,2.38 86.36,2.38
  pour Bottom (isolate 0.61): 2.79,96.23 2.54,1.74 125.98,1.87 125.85,96.23
LATCHEN
  Top 0.254: IC10.52 72.39,13.17 73.66,14.44 78.23,14.44 83.18,9.23 95.88,9.23 96.52,9.87 96.52,12.41 99.06,14.95 107.31,14.95 110.48,18.12 IC9.11
N$1  (via drill 0.7)
  Top 0.254: v22.86,16.98 26.67,16.98 27.94,15.71 27.94,10.63 v29.84,9.36
  Bottom 0.254: IC10.30 46.35,10.63 43.43,7.84 35.3,7.84 33.65,9.36 v29.84,9.36 | SV1.3 20.95,18.25 v22.86,16.98
N$2  (via drill 0.7)
  Top 0.254: v26.67,11.9 26.67,10.63 v29.21,8.09
  Bottom 0.254: IC10.59 71.75,13.17 69.21,10.63 57.14,10.63 55.88,9.36 46.35,9.36 44.19,7.2 34.16,7.2 33.78,6.82 31.11,6.82 v29.21,8.09 | SV1.4 20.32,15.71 23.49,11.9 v26.67,11.9
N$3  (via drill 0.7)
  Top 0.254: v36.82,10 34.92,6.82 28.57,6.82 26.03,9.36 23.49,9.36 19.68,13.17 SV1.5
  Bottom 0.254: IC10.28 46.35,13.17 43.17,10 v36.82,10
N$4  (via drill 0.7)
  Top 0.254: v37.46,8.73 36.82,8.09 35.55,6.18 28.32,6.18 27.81,6.69 23.49,6.69 22.86,7.33 22.86,8.73 20.95,10.63 SV1.6
  Bottom 0.254: IC10.29 48.25,11.9 46.35,11.9 43.17,8.73 v37.46,8.73
N$5
  Top 0.254: IC8.9 9.52,29.68 9.52,27.14 8.88,26.51 8.88,21.43 JP8.2
N$6
  Top 0.254: IC8.5 10.15,39.2 JP7.2
N$7
  Top 0.254: IC8.14 14.6,36.66 12.69,34.76 12.69,29.68 11.42,28.41 11.42,16.98 JP9.2
  Bottom 0.254: IC8.14 IC8.7
N$24  (via drill 0.7)
  Top 0.254: U1.36 73.66,81.75 v68.58,86.83
  Bottom 0.254: v68.58,86.83 U1.3 55.88,86.83 55.24,86.19 44.45,86.19 R2.1
NOROM
  Top 0.254: P1.5 19.05,67.14 17.14,70.95 JP2.1
PA0
  Bottom 0.254: P1.9 21.59,55.72 24.12,58.26 IC4.12
PA1
  Bottom 0.254: P1.10 21.59,53.18 24.12,50.63 IC4.15
PA2
  Bottom 0.254: P1.11 21.59,50.63 24.12,48.09 IC4.16
PA3
  Bottom 0.254: P1.12 22.22,48.09 23.49,46.83 26.67,46.83 27.94,48.09 27.94,53.81 29.84,55.72 29.84,56.98 31.11,58.26 IC4.9
PA4
  Bottom 0.254: IC8.2 10.15,49.37 11.42,48.09 17.78,48.09 18.41,47.46 P1.13 22.22,45.55 23.49,44.29 26.67,44.29 29.21,46.83 29.21,50 29.84,50.63 IC4.6
PA5
  Bottom 0.254: IC8.17 19.05,44.29 P1.14 21.59,43.02 24.12,40.48 IC4.19
PA6
  Bottom 0.254: IC8.4 10.79,44.29 12.06,43.02 17.78,43.02 18.41,42.38 P1.15 22.22,40.48 23.49,39.2 26.03,39.2 30.48,43.65 30.48,46.19 IC4.5
PA7
  Bottom 0.254: IC8.15 16.51,39.2 17.78,37.94 P1.16 22.22,37.94 23.49,36.66 26.67,36.66 30.48,40.48 IC4.2
PA8
  Top 0.254: P1.17 22.86,33.49 22.86,30.32 IC12.12
  Bottom 0.254: IC8.6 10.79,39.2 12.06,37.94 16.51,37.94 19.05,35.4 P1.17
PA9  (via drill 0.7)
  Top 0.254: P1.18 19.81,32.86 19.05,32.22 v19.05,26.51
  Bottom 0.254: IC8.13 16.51,34.12 17.14,33.49 19.05,33.49 19.68,32.86 P1.18 | v19.05,26.51 22.22,24.6 22.22,23.33 IC12.15
PA10
  Top 0.254: P1.19 22.86,28.41 22.86,20.16 IC12.16
  Bottom 0.254: IC8.8 10.79,34.12 12.06,32.86 16.51,32.86 19.05,30.32 P1.19
PA11
  Top 0.254: P1.20 20.95,26.51 21.59,25.87 21.59,13.81 IC12.19
  Bottom 0.254: IC8.11 19.05,29.05 P1.20
PA12  (via drill 0.7)
  Top 0.254: v29.21,27.14 29.21,22.06 29.84,21.43 29.84,13.17 IC12.2
  Bottom 0.254: P1.22 34.28,30.32 33.65,29.68 31.11,29.68 v29.21,27.14
PA13
  Top 0.254: P1.23 38.09,32.86 38.09,26.51 34.92,26.51 34.92,22.06 34.28,21.43 34.28,19.52 33.02,18.25 IC12.5
PA14
  Top 0.254: P1.24 34.28,35.4 34.28,22.7 IC12.6
PA15
  Top 0.254: P1.25 35.55,37.94 33.02,35.4 33.02,34.12 30.48,31.59 30.48,29.68 IC12.9
PD0
  Top 0.254: IC1.11 43.81,67.78 38.09,62.06 38.09,60.16 P1.33
PD1
  Top 0.254: IC1.12 44.45,65.24 38.09,58.89 38.09,57.62 P1.32
PD2
  Top 0.254: IC1.13 44.45,62.7 38.09,56.35 38.09,55.08 P1.31
PD3
  Top 0.254: IC1.14 44.45,60.16 38.09,53.81 38.09,52.54 P1.30
PD4
  Top 0.254: IC1.15 44.45,57.62 38.09,51.27 38.09,50 P1.29
PD5
  Top 0.254: IC1.16 44.45,55.08 38.09,48.73 38.09,47.46 P1.28
PD6
  Top 0.254: IC1.17 44.45,52.54 38.09,46.19 38.09,44.29 P1.27
PD7
  Top 0.254: IC1.18 44.45,50 38.73,43.65 P1.26
PETNOROM  (via drill 0.7)
  Top 0.254: v22.86,64.6 19.05,64.6 17.14,68.41 JP2.2 | IC10.15 48.25,32.22 48.25,34.12 45.71,36.66 45.71,38.57 44.45,39.84 44.45,41.74 43.17,43.02 v40.63,43.02
  Bottom 0.254: v40.63,43.02 40.63,43.65 41.27,44.29 41.27,65.24 38.73,67.14 25.39,67.14 v22.86,64.6
PETR/-W  (via drill 0.7)
  Top 0.254: v38.73,5.55 38.73,11.9 39.36,12.54 39.36,14.44 40,15.08 40,16.35 39.36,16.98 39.36,28.41 38.73,29.05 38.73,36.03 38.09,36.66 38.09,38.57 37.46,39.2 31.11,39.2 29.84,40.48 29.84,58.89 30.48,59.52 34.28,59.52 P1.34
  Bottom 0.254: v38.73,5.55 IC10.33
PETRDY  (via drill 0.7)
  Top 0.254: v44.45,12.54 v44.45,3.65 | v25.39,72.22 25.39,65.24 26.67,63.97 26.67,35.4 27.3,34.76 27.3,23.96 27.94,23.33 27.94,20.79 28.57,20.16 28.57,11.9 v29.21,11.27
  Bottom 0.254: IC10.39 57.14,4.28 56.51,3.65 v44.45,3.65 | P1.2 24.12,73.49 v25.39,72.22 | v29.21,11.27 30.48,11.27 31.11,11.9 36.19,11.9 36.82,11.27 38.73,11.27 39.36,11.9 43.81,11.9 v44.45,12.54
PETSYNC  (via drill 0.7)
  Top 0.254: P1.7 24.12,63.97 v24.12,82.38
  Bottom 0.254: v24.12,82.38 40.63,82.38 R3.1
PHI0  (via drill 0.7)
  Top 0.254: IC10.9 51.43,36.03 47.62,39.84 46.98,41.11 46.98,42.38 47.62,43.02 48.89,43.02 49.52,43.65 50.16,43.65 51.43,44.92 51.43,69.68 v52.06,70.32 | v45.71,70.32 41.27,70.32 39.36,68.41 P1.37
  Bottom 0.254: v52.06,70.32 v45.71,70.32
PHI1  (via drill 0.7)
  Top 0.254: v26.67,69.68 26.67,65.24 27.94,63.97 27.94,62.7 27.3,62.06 27.3,36.03 28.57,34.76 v28.57,32.22 | v45.08,20.79 46.35,22.06 48.25,22.06 IC10.23 53.97,20.79 v55.37,19.39 | v36.82,13.17 35.55,16.35 33.65,16.98 31.11,16.98 30.48,17.62 30.48,22.06 29.84,22.7 29.84,25.87 30.48,26.51 30.48,27.78 v29.21,29.05 | v62.22,16.22 IC10.44
  Bottom 0.254: P1.3 24.12,70.95 25.39,69.68 v26.67,69.68 | v45.08,20.79 43.17,20.79 38.09,16.98 37.46,16.35 v36.82,13.17 | v29.21,29.05 29.21,31.59 v28.57,32.22 | v55.37,19.39 59.05,19.39 v62.22,16.22
PHI1LOOP1
  Bottom 0.254: IC10.34 IC10.36 52.06,7.96
PHI1LOOP2  (via drill 0.7)
  Top 0.254: IC10.35 50.79,6.82 50.79,9.49 v51.94,10.63
  Bottom 0.254: v51.94,10.63 IC10.31
PHI2  (via drill 0.7)
  Top 0.254: v44.45,38.57 45.08,37.3 45.08,35.4 IC10.12
  Bottom 0.254: v44.45,38.57 44.45,40.48 43.17,41.74 43.17,75.4 38.09,75.4 P1.39
RA15
  Top 0.254: JP6.2 92.7,26.38 91.44,26.38 IC11.3
RA17  (via drill 0.7)
  Top 0.254: IC11.30 88.9,42.89 90.17,41.62 90.17,34 v88.9,32.73
  Bottom 0.254: v88.9,32.73 102.23,32.73 102.87,32.09 102.87,27.01 103.5,26.38 JP5.2
RA18
  Top 0.254: IC11.1 83.81,27.65 86.36,25.11 JP4.2
SLOWBUSLATCH  (via drill 0.7)
  Top 0.254: IC4.11 24.12,60.8 22.86,59.52 22.86,36.03 v23.49,35.4 23.49,32.22 IC12.11 | IC10.20 44.45,23.33 43.81,23.96 43.81,27.78 44.45,28.41 44.45,30.32 42.54,32.22 v42.54,33.49
  Bottom 0.254: v42.54,33.49 39.36,36.66 34.28,36.66 33.02,35.4 30.48,35.4 29.84,34.76 28.57,34.76 27.94,35.4 v23.49,35.4
VCC  (via drill 0.7)
  Top 0.254: 88.9,21.93 JP4.3 | 88.9,21.93 97.79,21.93 | 97.79,21.93 JP6.3 | 97.79,21.93 105.41,21.93 106.04,22.57 JP5.3 | 88.9,21.93 88.9,25.74 87.62,27.01 87.62,32.73 88.9,34 v88.9,39.08 | 15.23,2.38 JP1.3 | 8.88,10.63 8.9,10.65 8.9,10.66 | R3.2 R2.2 R1.2 R3.2 | 41.9,95.59 R3.2 | IC8.12 16.51,31.59 17.78,30.32 17.78,24.6 | JP10.3 12.69,80.99 13.46,81.11 19.05,81.11 QG1.1
  Top 0.406: C12.1 44.45,18.25 IC10.22 | 73.66,75.4 77.47,75.4
  Top 0.61: IC2.32 83.81,74.64 82.55,73.37 82.55,69.56 83.81,68.29 83.81,68.41 | 83.81,68.41 IC3.32 v83.81,60.16 83.81,53.68 82.55,52.41 82.55,47.97 83.81,46.7 IC11.32 v83.81,39.08 83.94,38.95 C15.1 78.1,40.48 76.83,41.74 74.29,41.74 73.02,40.48 71.12,40.48 | U1.8 64.77,77.94 v64.77,83.02 64.77,95.59 | IC10.38 53.34,6.82 53.34,1.74 | IC10.38 55.88,6.82 55.88,1.74 | 76.2,22.06 73.66,22.06 72.39,23.33 72.39,28.41 IC10.73 | IC10.38 54.6,16.98 52.06,19.52 48.25,19.52 IC10.22 | 125.73,41.11 C10.1 | 125.73,63.34 C9.1 | U1.8 C7.1 | IC10.78 71.12,34.76 71.12,40.48 | 2.54,46.83 IC8.3 | IC8.16 14.6,41.74 13.33,43.02 13.33,46.19 13.96,46.83 | IC8.18 13.96,46.83 | 13.96,46.83 13.33,47.46 13.33,51.27 13.96,51.91 IC8.20 15.23,54.45 C3.1 13.96,59.52 C16.+ | 8.9,10.65 10.15,12.54 12.69,15.08 JP9.1 JP8.1 JP7.1 17.78,24.6 SV1.1 | IC4.20 24.76,37.3 C5.1 | 11.83,90.96 13.01,91.09 12.69,90 C4.1 15.23,90 16.51,91.27 QG1.14 QG1.1 28.57,83.65 30.48,81.75 v30.48,80.48 v30.48,65.24 | IC1.20 48.89,46.83 v48.89,74.13 v48.89,80.48 48.89,95.59 | 71.12,40.48 69.21,42.38 67.94,42.38 v66.67,41.11 | C6.1 50.16,41.11 v52.7,43.65 | 83.81,68.41 v81.91,68.41 | 73.66,75.4 72.39,74.13 U1.8 | 77.47,75.4 78.73,74.13 v78.73,72.22
  Top 0.813: 116.2,89.24 116.2,87.97 | 115.56,6.82 121.28,11.27 125.73,11.27 125.73,14.31 125.73,21.93 125.73,41.11 125.73,63.34 125.73,80.99 C8.1 | 41.27,2.38 41.27,10.63 43.17,12.54 43.17,16.98 C12.1 41.9,30.95 41.27,31.59 41.27,34.12 C13.1 v42.54,37.94 | v115.56,80.99 115.56,89.24 | 118.11,88.61 v118.11,80.99 | 26.03,2.38 C14.1
  Top 1.016: 41.27,2.38 43.17,1.74 53.34,1.74 55.88,1.74 85.09,1.74 86.36,2.38 84.96,2.88 v83.81,3.14 | 83.81,18.76 83.05,18.76 81.02,20.79 IC10.64 76.2,22.06 | 83.81,18.76 IC9.20 | C1.1 83.81,18.76 | 85.72,95.59 C11.1 85.72,89.88 83.81,87.97 IC2.32 | 125.73,21.93 JP3.4 | 125.73,14.31 JP3.1 | P1.8 C16.+ 13.33,60.16 12.95,59.78 2.54,59.78
  Top 1.27: 14.73,95.59 11.83,90.96 8.88,87.85 2.54,87.85 2.54,59.78 2.54,46.83 2.54,12.54 6.45,12.03 8.9,10.66 12.06,4.92 12.06,2.38 | 116.2,90.51 118.11,88.61
  Top 1.422: 114.3,2.38 115.56,6.82
  Top 2.54: 14.73,95.59 41.9,95.59 48.89,95.59 64.77,95.59 85.72,95.59 116.2,95.59 116.2,90.51 116.2,89.24 | 12.06,2.38 15.23,2.38 26.03,2.38 41.27,2.38 | 86.36,2.38 114.3,2.38
  Bottom 0.406: v64.77,83.02 55.88,83.02
  Bottom 0.61: IC10.73 IC10.78 | v115.56,80.99 114.93,80.99 112.39,83.53 86.36,83.53 IC2.32 | C9.1 123.82,60.16 v83.81,60.16 | C10.1 v88.9,39.08 v83.81,39.08 | IC1.20 46.98,42.38 C6.1 48.25,39.2 46.35,37.3 43.81,37.3 43.17,37.94 v42.54,37.94 | IC8.3 IC8.18 | IC8.16 17.78,41.74 18.41,39.2 22.22,39.2 23.49,37.94 IC4.20 | P1.8 22.86,59.52 26.03,59.52 v30.48,65.24 | v30.48,80.48 v48.89,80.48 53.34,80.48 55.88,83.02 | v48.89,74.13 50.16,74.13 50.79,73.49 56.51,73.49 C7.1 | v66.67,41.11 57.78,41.11 56.51,42.38 53.97,42.38 v52.7,43.65 | v78.73,72.22 81.78,70.19 81.78,68.41
  Bottom 0.813: v115.56,80.99 v118.11,80.99 C8.1 | C14.1 24.76,7.46 IC12.20
  Bottom 1.016: C1.1 82.55,17.49 81.28,16.22 81.28,11.14 83.81,8.6 v83.81,3.14
  pour Top (isolate 0.61): 2.54,60.16 2.54,1.74 125.98,1.74 125.98,96.23 9.39,96.23 9.39,60.16

### Text on the board
Top: AUXCONF | NOROM | (C) A. Fachat | PET-CPU816-V1.2B | $FBF | 1 | Pwr | $BFF | ISP | $CFF | $FFF | BOOT | ROM
tPlace: AUXCONF | NOROM | (C) A. Fachat | PET-CPU816-V1.2B | 65816 | CA18/CA15/CA17 | Pwr | $FBF | CAx <-> VCC | XC95108 | $BFF | $CFF | ISP Conn. | $FFF | ON | BOOTROM | DIAG